# EAGLE design BinaryEnvelope (EAGLE 7.5.0)
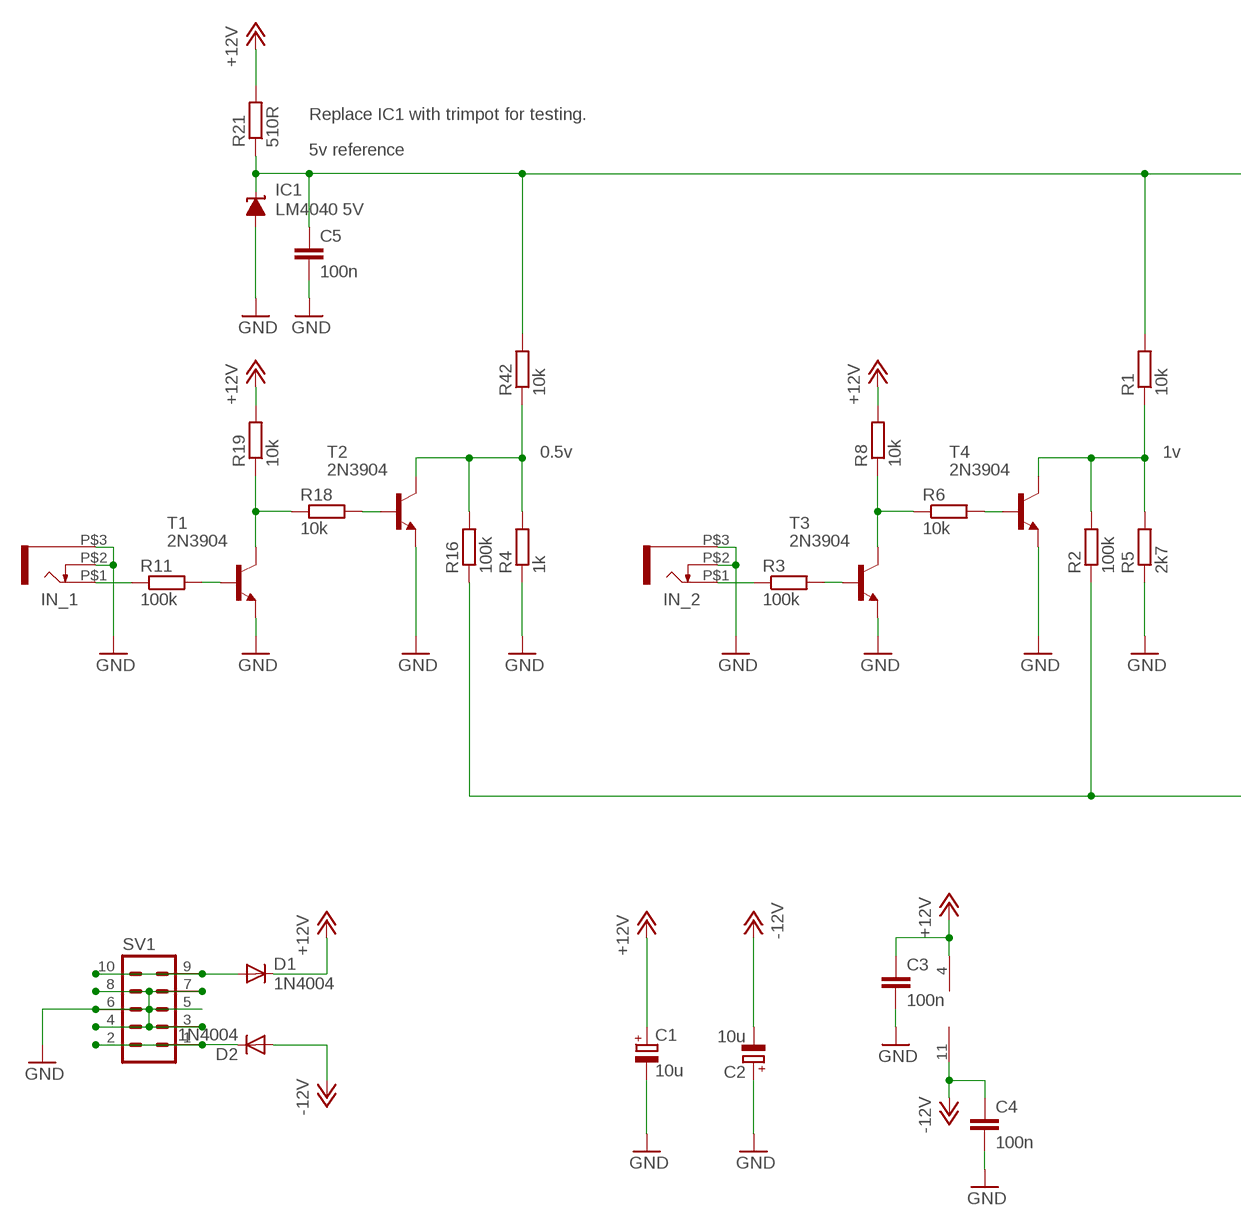
[diagram p0: schematic, sheet 1, part 1 of 2]
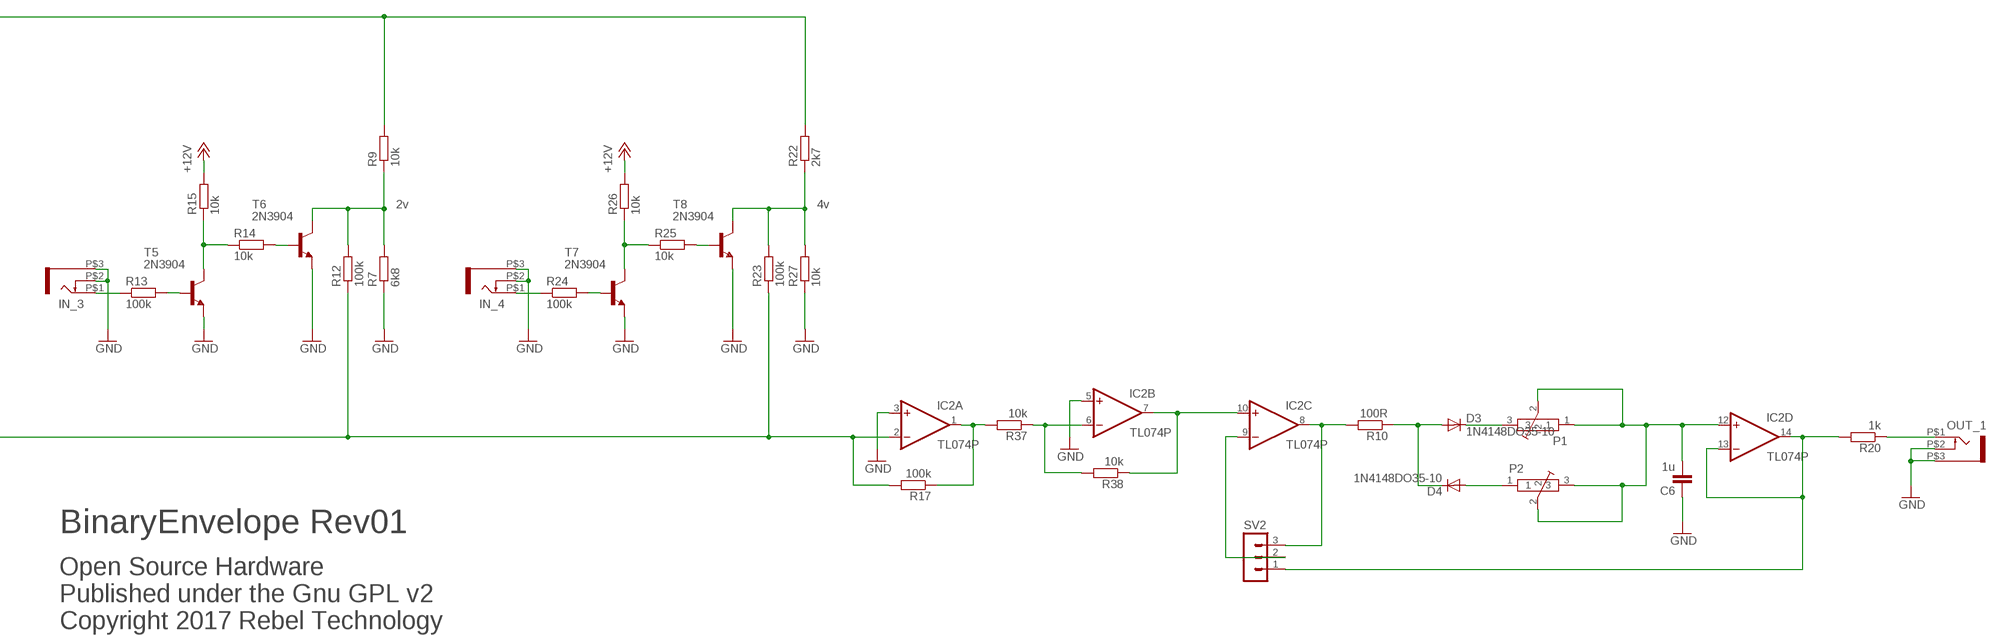
[diagram p1: schematic, sheet 1, part 2 of 2]

## Parts
C1  10u  CPOL-EU153CLV-0505  [153CLV-0505]
C2  10u  CPOL-EU153CLV-0505  [153CLV-0505]
C3  100n  C-EUC0603  [C0603]
C4  100n  C-EUC0603  [C0603]
C5  100n  C-EUC0603  [C0603]
C6  1u  C-EUC0603  [C0603]
D1  1N4004  [DO41-10]
D2  1N4004  [DO41-10]
D3  1N4148DO35-10  [DO35-10]
D4  1N4148DO35-10  [DO35-10]
IC1  LM4040 5V  LM4041A12LP  [LP_O-PBCY-W3]
IC2  TL074P  [DIL14]
IN_1  JACK-UJ-3502-R  [UJ-3502-R]
IN_2  JACK-UJ-3502-R  [UJ-3502-R]
IN_3  JACK-UJ-3502-R  [UJ-3502-R]
IN_4  JACK-UJ-3502-R  [UJ-3502-R]
OUT_1  JACK-UJ-3502-R  [UJ-3502-R]
P1  POT-BOURNS-PTD901  [POT-BOURNS-PTD901]
P2  POT-BOURNS-PTD901  [POT-BOURNS-PTD901]
R1  10k  R-EU_0204/7  [0204/7]
R2  100k  R-EU_0204/7  [0204/7]
R3  100k  R-EU_0204/7  [0204/7]
R4  1k  R-EU_0204/7  [0204/7]
R5  2k7  R-EU_0204/7  [0204/7]
R6  10k  R-EU_0204/7  [0204/7]
R7  6k8  R-EU_0204/7  [0204/7]
R8  10k  R-EU_0204/7  [0204/7]
R9  10k  R-EU_0204/7  [0204/7]
R10  100R  R-EU_0204/7  [0204/7]
R11  100k  R-EU_0204/7  [0204/7]
R12  100k  R-EU_0204/7  [0204/7]
R13  100k  R-EU_0204/7  [0204/7]
R14  10k  R-EU_0204/7  [0204/7]
R15  10k  R-EU_0204/7  [0204/7]
R16  100k  R-EU_0204/7  [0204/7]
R17  100k  R-EU_0204/7  [0204/7]
R18  10k  R-EU_0204/7  [0204/7]
R19  10k  R-EU_0204/7  [0204/7]
R20  1k  R-EU_0204/7  [0204/7]
R21  510R  R-EU_0204/7  [0204/7]
R22  2k7  R-EU_0204/7  [0204/7]
R23  100k  R-EU_0204/7  [0204/7]
R24  100k  R-EU_0204/7  [0204/7]
R25  10k  R-EU_0204/7  [0204/7]
R26  10k  R-EU_0204/7  [0204/7]
R27  10k  R-EU_0204/7  [0204/7]
R37  10k  R-EU_0204/7  [0204/7]
R38  10k  R-EU_0204/7  [0204/7]
R42  10k  R-EU_0204/7  [0204/7]
SV1  MA05-2  [MA05-2]
SV2  MA03-1  [MA03-1]
T1  2N3904  [TO92]
T2  2N3904  [TO92]
T3  2N3904  [TO92]
T4  2N3904  [TO92]
T5  2N3904  [TO92]
T6  2N3904  [TO92]
T7  2N3904  [TO92]
T8  2N3904  [TO92]

## Nets
+12V: C1.+ C3.1 D1.C IC2.4(P:V+) R8.2 R15.2 R19.2 R21.2 R26.2
-12V: C2.- C4.1 D2.A IC2.11(P:V-)
GND: C1.- C2.+ C3.2 C4.2 C5.2 C6.1 IC1.3(A) IC2.3(A:+IN) IC2.5(B:+IN) IN_1.P$2(SW) IN_1.P$3(SLEEVE) IN_2.P$2(SW) IN_2.P$3(SLEEVE) IN_3.P$2(SW) IN_3.P$3(SLEEVE) IN_4.P$2(SW) IN_4.P$3(SLEEVE) OUT_1.P$2(SW) OUT_1.P$3(SLEEVE) R4.1 R5.1 R7.1 R27.1 SV1.3 SV1.4 SV1.5 SV1.6 SV1.7 SV1.8 T1.3(E) T2.3(E) T3.3(E) T4.3(E) T5.3(E) T6.3(E) T7.3(E) T8.3(E)
N$1: D2.C SV1.1 SV1.2
N$3: IN_1.P$1(TIP) R11.1
N$5: R1.1 R2.2 R5.2 T4.1(C)
N$8: OUT_1.P$1(TIP) R20.1
N$9: D3.A D4.C R10.1
N$10: IC2.8(C:OUT) R10.2 SV2.3
N$11: C6.2 IC2.12(D:+IN) P1.1 P1.2 P2.2 P2.3
N$12: IC2.6(B:-IN) R37.1 R38.2
N$13: R3.2 T3.2(B)
N$14: D1.A SV1.9 SV1.10
N$15: R6.2 T4.2(B)
N$16: R6.1 R8.1 T3.1(C)
N$17: IN_2.P$1(TIP) R3.1
N$19: C5.1 IC1.2(C) R1.2 R9.2 R21.1 R22.2 R42.2
N$20: R11.2 T1.2(B)
N$21: R18.2 T2.2(B)
N$22: D3.C P1.3
N$23: R7.2 R9.1 R12.2 T6.1(C)
N$24: IC2.13(D:-IN) IC2.14(D:OUT) R20.2 SV2.1
N$25: R18.1 R19.1 T1.1(C)
N$26: R13.2 T5.2(B)
N$27: R14.2 T6.2(B)
N$28: R14.1 R15.1 T5.1(C)
N$29: IN_3.P$1(TIP) R13.1
N$31: D4.A P2.1
N$32: R22.1 R23.2 R27.2 T8.1(C)
N$33: IC2.7(B:OUT) IC2.10(C:+IN) R38.1
N$34: R24.2 T7.2(B)
N$35: IC2.1(A:OUT) R17.1 R37.2
N$36: R25.2 T8.2(B)
N$37: R25.1 R26.1 T7.1(C)
N$38: IN_4.P$1(TIP) R24.1
N$40: IC2.9(C:-IN) SV2.2
N$44: R4.2 R16.2 R42.1 T2.1(C)
N$61: IC2.2(A:-IN) R2.1 R12.1 R16.1 R17.2 R23.1

## Notes on the sheet
- Replace IC1 with trimpot for testing.
- 5v reference
- 0.5v | 1v | 2v | 4v
- BinaryEnvelope Rev01
- Open Source Hardware
  Published under the Gnu GPL v2
  Copyright 2017 Rebel Technology

## Library data of the parts
C1 C2 = rcl:CPOL-EU: POLARIZED CAPACITOR, European symbol
C3-C6 = Rebel:C-EU: CAPACITOR, European symbol
D1 D2 = diode:1N4004: DIODE general purpose rectifier, 1 A
D3 D4 = diode:1N4148: DIODE high speed (Philips)
IC1 = texas:LM4041: PRECISION MICROPOWER SHUNT VOLTAGE REFERENCE Source: http://focus.ti.com/lit/ds/slcs146e/slcs146e.pdf; OC_FARNELL: 9486119; OC_NEWARK: unknown
IC2 = linear:TL074: OP AMP
IN_1-IN_4 OUT_1 = Rebel:JACK-UJ-3502-R
P1 P2 = Rebel:POT-BOURNS-PTD901
R1-R27 R37 R38 R42 = Rebel:R-EU_: RESISTOR, European symbol
SV1 = con-lstb:MA05-2: PIN HEADER; OC_FARNELL: unknown; OC_NEWARK: unknown
SV2 = con-lstb:MA03-1: PIN HEADER; OC_FARNELL: unknown; OC_NEWARK: unknown
T1-T8 = transistor:2N3904: NPN TRANSISTOR

## Module TRIGGER
Ports: TR_IN(io)
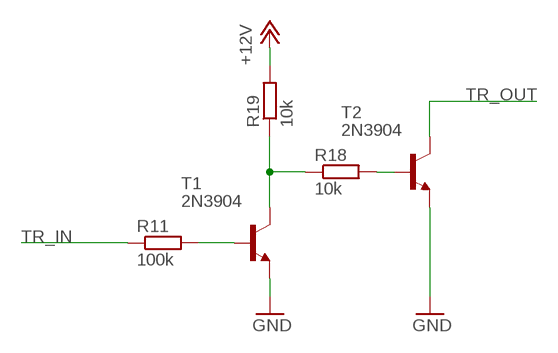
[diagram p2: schematic, module TRIGGER, sheet 1]

### Parts
R11  100k  R-EU_0204/7  [0204/7]
R18  10k  R-EU_0204/7  [0204/7]
R19  10k  R-EU_0204/7  [0204/7]
T1  2N3904  [TO92]
T2  2N3904  [TO92]

### Nets
+12V: R19.2
GND: T1.3(E) T2.3(E)
N$7: R11.2 T1.2(B)
N$8: R18.2 T2.2(B)
N$9: R18.1 R19.1 T1.1(C)
TR_IN: R11.1
TR_OUT: T2.1(C)

### Library data of the parts
R11 R18 R19 = Rebel:R-EU_: RESISTOR, European symbol
T1 T2 = transistor:2N3904: NPN TRANSISTOR

## Board
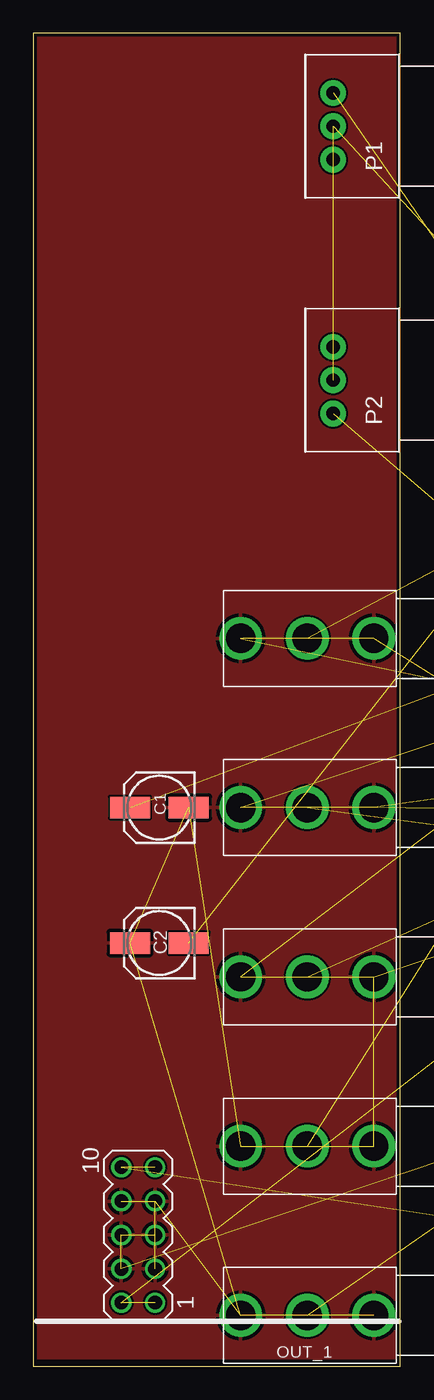
[diagram p3: board, top side]
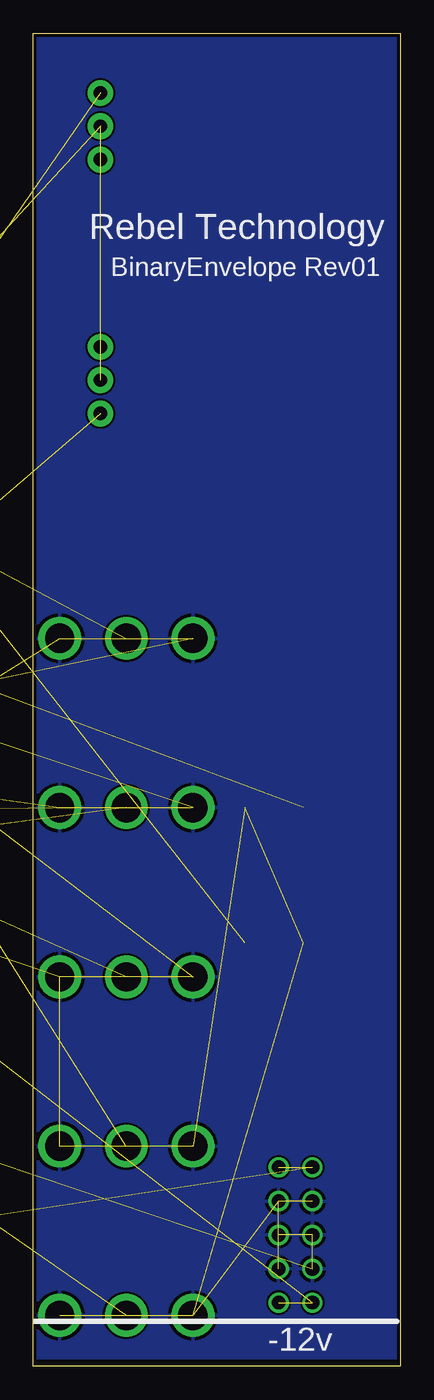
[diagram p4: board, bottom side, seen from below]

Size 27.56 x 100 mm. Coordinates in mm from the lower left corner, seen from the top.
Outline: 27.56,0 27.56,100 0,100 0,0 27.56,0
Copper layers (1*16): Top 0.035mm / dielectric 1.5mm / Bottom 0.035mm
Design rules "SeeedStudio_2layer_DRU_no_angle_20140221": minimum track width 6mil, minimum drill 12mil, track to track 6mil, track to pad 6mil, pad to pad 6mil, via to via 6mil, smd to smd 0mil, copper to edge 10mil, drill to drill 10mil, minimum pad ring 10mil, minimum via ring 6mil, stop-mask expansion 2mil, vias tented up to drill 100mil, thermal gap 10mil

### Footprints (pad centres in the part's own frame; a part is rotated, then mirrored left to right if it is on the bottom)
153CLV-0505 = smd 3 x 1.6: + 2.2,0; - -2.2,0
C0603 = smd 1.1 x 1: 1 -0.85,0; 2 0.85,0
DO41-10 = drill 1.118: A 5.08,0; C -5.08,0
DO35-10 = drill 0.813 long: A 5.08,0; C -5.08,0
LP_O-PBCY-W3 = drill 0.8 pad 1.4: 1 -2.54,0; 2 0,0; 3 2.54,0
DIL14 = drill 0.813 long: 1 -7.62,-3.81; 2 -5.08,-3.81; 3 -2.54,-3.81; 4 0,-3.81; 5 2.54,-3.81; 6 5.08,-3.81; 7 7.62,-3.81; 8 7.62,3.81; 9 5.08,3.81; 10 2.54,3.81; 11 0,3.81; 12 -2.54,3.81; 13 -5.08,3.81; 14 -7.62,3.81
UJ-3502-R = drill 2.2: P$1 0,0; P$2 0,5; P$3 0,-5
POT-BOURNS-PTD901 = drill 1 pad 1.93: 1 -2.5,-0.036; 2 0,-0.036; 3 2.5,-0.036
0204/7 = drill 0.813: 1 -3.81,0; 2 3.81,0
MA05-2 = drill 1.016: 1 -5.08,-1.27; 2 -5.08,1.27; 3 -2.54,-1.27; 4 -2.54,1.27; 5 0,-1.27; 6 0,1.27; 7 2.54,-1.27; 8 2.54,1.27; 9 5.08,-1.27; 10 5.08,1.27
MA03-1 = drill 1.016 long: 1 -2.54,0; 2 0,0; 3 2.54,0
TO92 = drill 0.813 octagon: 1 1.27,0; 2 0,1.905; 3 -1.27,0

### Placement (x,y rotation side)
C1  9.46,41.91 180 top
C2  9.46,31.75 180 top
C3  52.32,86.36 0 top  (outside the outline)
C4  52.32,82.55 0 top  (outside the outline)
C5  49.78,55.88 0 top  (outside the outline)
C6  67.56,43.18 0 top  (outside the outline)
D1  82.8,2.54 0 top  (outside the outline)
D2  99.31,72.39 0 top  (outside the outline)
D3  72.64,30.48 0 top  (outside the outline)
D4  72.64,24.13 0 top  (outside the outline)
IC1  49.78,71.12 0 top  (outside the outline)
IC2  95.5,55.88 0 top  (outside the outline)
IN_1  20.57,16.51 90 top
IN_2  20.57,29.21 90 top
IN_3  20.57,41.91 90 top
IN_4  20.57,54.61 90 top
OUT_1  20.57,3.81 90 top
P1  22.48,93.03 90 top
P2  22.48,73.98 90 top
R1  115.82,63.5 0 top  (outside the outline)
R2  119.63,63.5 0 top  (outside the outline)
R3  109.47,67.31 0 top  (outside the outline)
R4  90.42,34.29 0 top  (outside the outline)
R5  90.42,30.48 0 top  (outside the outline)
R6  119.63,67.31 0 top  (outside the outline)
R7  90.42,26.67 0 top  (outside the outline)
R8  109.47,63.5 0 top  (outside the outline)
R9  120.9,26.67 0 top  (outside the outline)
R10  78.99,46.99 0 top  (outside the outline)
R11  61.21,74.93 0 top  (outside the outline)
R12  117.09,26.67 0 top  (outside the outline)
R13  109.47,30.48 0 top  (outside the outline)
R14  119.63,30.48 0 top  (outside the outline)
R15  109.47,26.67 0 top  (outside the outline)
R16  53.59,97.79 0 top  (outside the outline)
R17  59.94,17.78 0 top  (outside the outline)
R18  61.21,71.12 0 top  (outside the outline)
R19  61.21,67.31 0 top  (outside the outline)
R20  70.1,35.56 0 top  (outside the outline)
R21  51.05,59.69 0 top  (outside the outline)
R22  89.15,81.28 0 top  (outside the outline)
R23  92.96,81.28 0 top  (outside the outline)
R24  81.53,85.09 0 top  (outside the outline)
R25  91.69,85.09 0 top  (outside the outline)
R26  81.53,81.28 0 top  (outside the outline)
R27  90.42,22.86 0 top  (outside the outline)
R37  47.24,13.97 0 top  (outside the outline)
R38  47.24,10.16 0 top  (outside the outline)
R42  43.43,36.83 0 top  (outside the outline)
SV1  7.87,9.84 90 top
SV2  47.24,5.08 0 top  (outside the outline)
T1  58.67,85.09 0 top  (outside the outline)
T2  58.67,80.01 0 top  (outside the outline)
T3  108.2,77.47 0 top  (outside the outline)
T4  108.2,72.39 0 top  (outside the outline)
T5  108.2,40.64 0 top  (outside the outline)
T6  108.2,35.56 0 top  (outside the outline)
T7  108.2,3.81 0 top  (outside the outline)
T8  80.26,90.17 0 top  (outside the outline)

### Tracks (layer width: path | path; a pad name or v marks a point on that pad's centre or on a via)
+12V  (8 unrouted)
-12V  (3 unrouted)
GND  (36 unrouted)
  pour Bottom: -9.91,0.64 34.54,0.64 34.54,100.97 -9.91,100.97
  pour Top: -8.64,0.64 35.81,0.64 35.81,100.97 -8.64,100.97
N$1  (2 unrouted)
N$3  (1 unrouted)
N$5  (3 unrouted)
N$8  (1 unrouted)
N$9  (2 unrouted)
N$10  (2 unrouted)
N$11  (5 unrouted)
N$12  (2 unrouted)
N$13  (1 unrouted)
N$14  (2 unrouted)
N$15  (1 unrouted)
N$16  (2 unrouted)
N$17  (1 unrouted)
N$19  (6 unrouted)
N$20  (1 unrouted)
N$21  (1 unrouted)
N$22  (1 unrouted)
N$23  (3 unrouted)
N$24  (3 unrouted)
N$25  (2 unrouted)
N$26  (1 unrouted)
N$27  (1 unrouted)
N$28  (2 unrouted)
N$29  (1 unrouted)
N$31  (1 unrouted)
N$32  (3 unrouted)
N$33  (2 unrouted)
N$34  (1 unrouted)
N$35  (2 unrouted)
N$36  (1 unrouted)
N$37  (2 unrouted)
N$38  (1 unrouted)
N$40  (1 unrouted)
N$44  (3 unrouted)
N$61  (5 unrouted)

### Text on the board
bPlace: Rebel Technology | BinaryEnvelope Rev01 | -12v